# Altium schematic sheet 02_Block Diagram.SchDoc
size A3
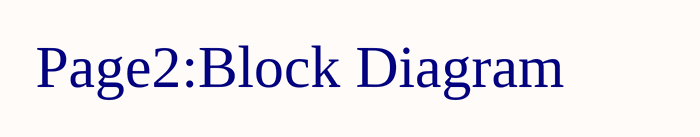
[diagram p0: 02_Block Diagram.SchDoc]

## Notes on the sheet
- Page2:Block Diagram
- Drawn by
- Project
- Title
- Version
- Sheet of
- Date